# Altium schematic sheet Module A IO.SchDoc
size A2; SheetNumber: 4; SheetTotal: 7
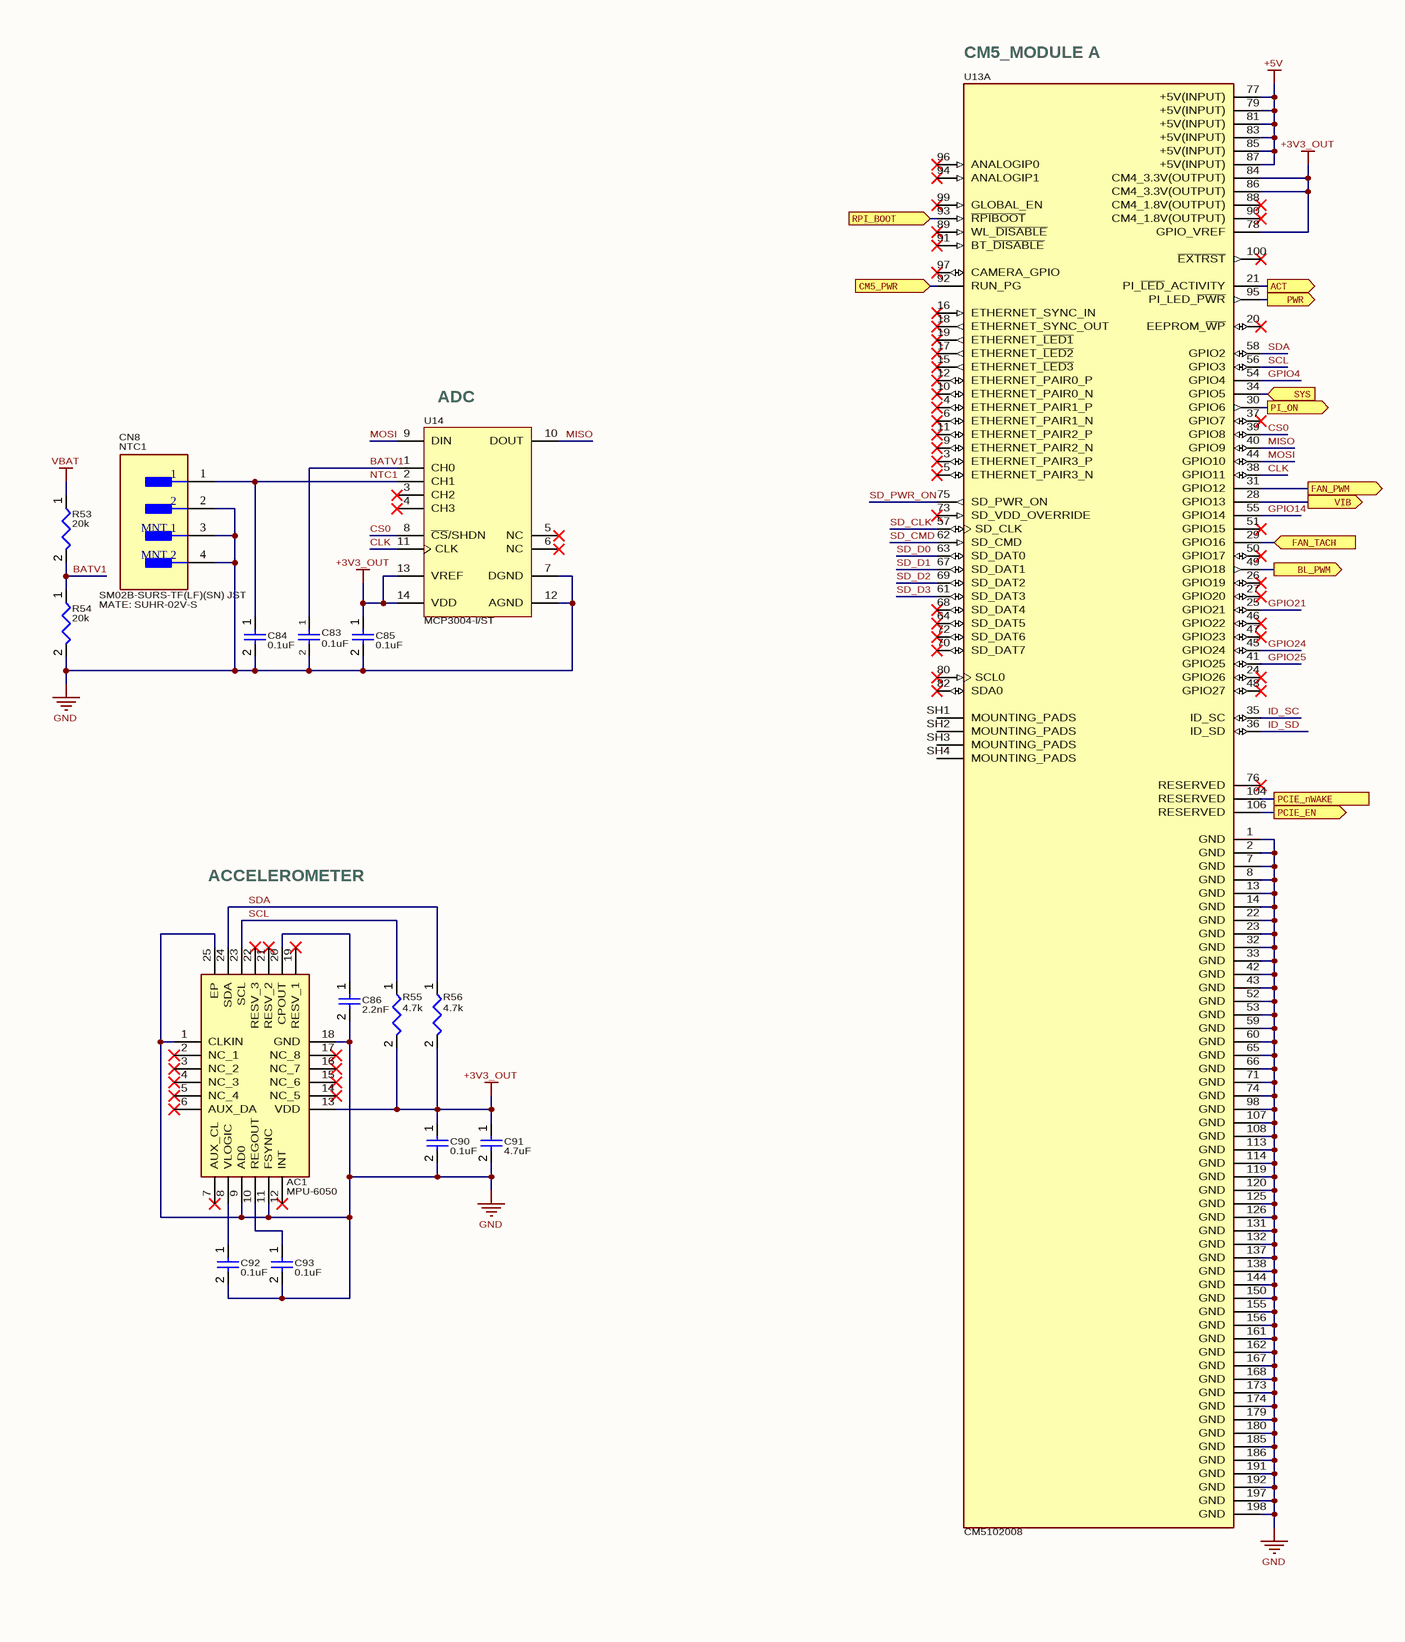
[diagram p0: Module A IO.SchDoc, left]
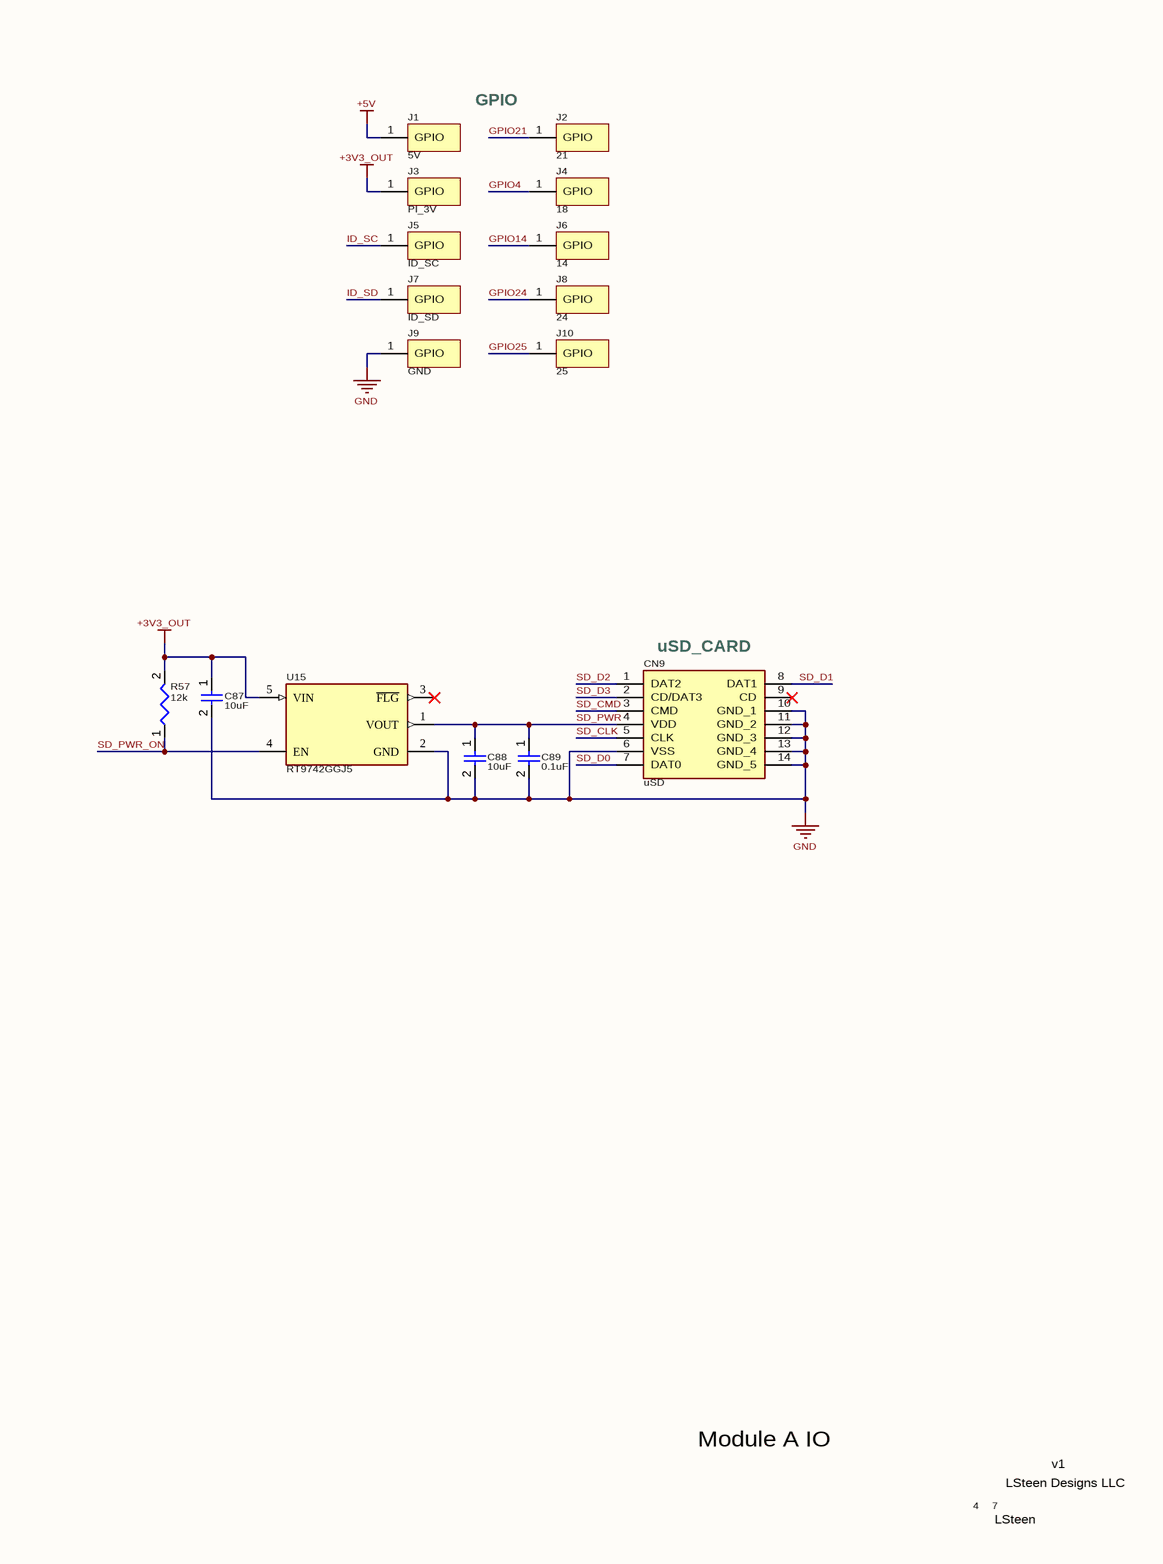
[diagram p1: Module A IO.SchDoc, right]

## Parts
AC1  MPU-6050  [MPU6050]
C83  0.1uF  [CAPC1005X55N]
C84  0.1uF  [CAPC1005X56X25LL10T15]
C85  0.1uF  [CAPC1005X56X25LL10T15]
C86  2.2nF  [CAPC1005X56X25LL10T15]
C87  10uF  [CAPC0603(1608)100_L]
C88  10uF  [CAPC0603(1608)100_L]
C89  0.1uF  [CAPC1005X56X25LL10T15]
C90  0.1uF  [CAPC1005X56X25LL10T15]
C91  4.7uF  [CAPC0603(1608)100_L]
C92  0.1uF  [CAPC1005X56X25LL10T15]
C93  0.1uF  [CAPC1005X56X25LL10T15]
CN8  NTC1  [FP-SM02B-SURS-TF_LF_SN-MFG]
CN9  uSD  [MSD9A]
J1  5V  [GPIO]
J2  21  [GPIO]
J3  PI_3V  [GPIO]
J4  18  [GPIO]
J5  ID_SC  [GPIO]
J6  14  [GPIO]
J7  ID_SD  [GPIO]
J8  24  [GPIO]
J9  GND  [GPIO]
J10  25  [GPIO]
R53  20k  [RESC0402(1005)_L]
R54  20k  [RESC0402(1005)_L]
R55  4.7k  [RESC0402(1005)_L]
R56  4.7k  [RESC0402(1005)_L]
R57  12k  [RESC0402(1005)_L]
U13  CM5102008  [MODULE_CM4102008]  (part A of 2)
U14  MCP3004-I/ST  [TSSOP-ST14_M]
U15  RT9742GGJ5  [FP-RT9742GGJ5-IPC_C]

## Ports
ACT (out, see USB[5B]), BL_PWM (out, see Power[5B]), CM5_PWR (in, see Power[5D]), FAN_PWM (out, see Power[4C]), FAN_TACH (in, see Power[4C]), PCIE_EN (out, see USB[6B]), PCIE_nWAKE (see USB[7B]), PI_ON (out, see Power[6D]), PWR (out, see USB[5B]), RPI_BOOT (in, see USB[6D]), SYS (in, see USB[5B]), VIB (out, see USB[7B])

## Nets
+3V3_OUT: AC1.13(VDD) C85.1 C87.1 C90.1 C91.1 J3.1(GPIO) R55.2 R56.2 R57.2 U13.78(GPIO_VREF) U13.84(CM4_3.3V(OUTPUT)) U13.86(CM4_3.3V(OUTPUT)) U14.13(VREF) U14.14(VDD) U15.5(VIN)
+5V: J1.1(GPIO) U13.77(+5V(INPUT)) U13.79(+5V(INPUT)) U13.81(+5V(INPUT)) U13.83(+5V(INPUT)) U13.85(+5V(INPUT)) U13.87(+5V(INPUT))
GND: AC1.1(CLKIN) AC1.9(AD0) AC1.11(FSYNC) AC1.18(GND) AC1.25(EP) C83.2 C84.2 C85.2 C86.2 C87.2 C88.2 C89.2 C90.2 C91.2 C92.2 C93.2 CN8.2 CN8.3(MNT_1) CN8.4(MNT_2) CN9.6(VSS) CN9.10(GND_1) CN9.11(GND_2) CN9.12(GND_3) CN9.13(GND_4) CN9.14(GND_5) J9.1(GPIO) R54.2 U13.1(GND) U13.2(GND) U13.7(GND) U13.8(GND) U13.13(GND) U13.14(GND) U13.22(GND) U13.23(GND) U13.32(GND) U13.33(GND) U13.42(GND) U13.43(GND) U13.52(GND) U13.53(GND) U13.59(GND) U13.60(GND) U13.65(GND) U13.66(GND) U13.71(GND) U13.74(GND) U13.98(GND) U13.107(GND) U13.108(GND) U13.113(GND) U13.114(GND) U13.119(GND) U13.120(GND) U13.125(GND) U13.126(GND) U13.131(GND) U13.132(GND) U13.137(GND) U13.138(GND) U13.144(GND) U13.150(GND) U13.155(GND) U13.156(GND) U13.161(GND) U13.162(GND) U13.167(GND) U13.168(GND) U13.173(GND) U13.174(GND) U13.179(GND) U13.180(GND) U13.185(GND) U13.186(GND) U13.191(GND) U13.192(GND) U13.197(GND) U13.198(GND) U14.7(DGND) U14.12(AGND) U15.2(GND)
VBAT: R53.1
ACT: U13.21(PI_~{LED}_ACTIVITY) ; port ACT
BATV1: C83.1 R53.2 R54.1 U14.1(CH0)
BL_PWM: U13.49(GPIO18) ; port BL_PWM
CLK: U13.38(GPIO11) U14.11(CLK)
CM5_PWR: U13.92(RUN_PG) ; port CM5_PWR
CS0: U13.39(GPIO8) U14.8(~{CS}/SHDN)
FAN_PWM: U13.31(GPIO12) ; port FAN_PWM
FAN_TACH: U13.29(GPIO16) ; port FAN_TACH
GPIO4: J4.1(GPIO) U13.54(GPIO4)
GPIO14: J6.1(GPIO) U13.55(GPIO14)
GPIO21: J2.1(GPIO) U13.25(GPIO21)
GPIO24: J8.1(GPIO) U13.45(GPIO24)
GPIO25: J10.1(GPIO) U13.41(GPIO25)
ID_SC: J5.1(GPIO) U13.35(ID_SC)
ID_SD: J7.1(GPIO) U13.36(ID_SD)
MISO: U13.40(GPIO9) U14.10(DOUT)
MOSI: U13.44(GPIO10) U14.9(DIN)
NTC1: C84.1 CN8.1 U14.2(CH1)
PCIE_EN: U13.106(RESERVED) ; port PCIE_EN
PCIE_nWAKE: U13.104(RESERVED) ; port PCIE_nWAKE
PI_ON: U13.30(GPIO6) ; port PI_ON
PWR: U13.95(PI_LED_~{PWR}) ; port PWR
RPI_BOOT: U13.93(~{RPIBOOT}) ; port RPI_BOOT
SCL: AC1.23(SCL) R55.1 U13.56(GPIO3)
SD_CLK: CN9.5(CLK) U13.57(SD_CLK)
SD_CMD: CN9.3(CMD) U13.62(SD_CMD)
SD_D0: CN9.7(DAT0) U13.63(SD_DAT0)
SD_D1: CN9.8(DAT1) U13.67(SD_DAT1)
SD_D2: CN9.1(DAT2) U13.69(SD_DAT2)
SD_D3: CN9.2(CD/DAT3) U13.61(SD_DAT3)
SD_PWR: C88.1 C89.1 CN9.4(VDD) U15.1(VOUT)
SD_PWR_ON: R57.1 U13.75(SD_PWR_ON) U15.4(EN)
SDA: AC1.24(SDA) R56.1 U13.58(GPIO2)
SYS: U13.34(GPIO5) ; port SYS
VIB: U13.28(GPIO13) ; port VIB
NetAC1_8: AC1.8(VLOGIC) C92.1
NetAC1_10: AC1.10(REGOUT) C93.1
NetAC1_20: AC1.20(CPOUT) C86.1

Not connected (* = marked no-connect by the designer): AC1 2(NC_1)* 3(NC_2)* 4(NC_3)* 5(NC_4)* 6(AUX_DA)* 7(AUX_CL)* 12(INT)* 14(NC_5)* 15(NC_6)* 16(NC_7)* 17(NC_8)* 19(RESV_1)* 21(RESV_2)* 22(RESV_3)*; CN9 9(CD)*; U13 3(ETHERNET_PAIR3_P)* 4(ETHERNET_PAIR1_P)* 5(ETHERNET_PAIR3_N)* 6(ETHERNET_PAIR1_N)* 9(ETHERNET_PAIR2_N)* 10(ETHERNET_PAIR0_N)* 11(ETHERNET_PAIR2_P)* 12(ETHERNET_PAIR0_P)* 15(ETHERNET_~{LED3})* 16(ETHERNET_SYNC_IN)* 17(ETHERNET_~{LED2})* 18(ETHERNET_SYNC_OUT)* 19(ETHERNET_~{LED1})* 20(EEPROM_~{WP})* 24(GPIO26)* 26(GPIO19)* 27(GPIO20)* 37(GPIO7)* 46(GPIO22)* 47(GPIO23)* 48(GPIO27)* 50(GPIO17)* 51(GPIO15)* 64(SD_DAT5)* 68(SD_DAT4)* 70(SD_DAT7)* 72(SD_DAT6)* 73(SD_VDD_OVERRIDE)* 76(RESERVED)* 80(SCL0)* 82(SDA0)* 88(CM4_1.8V(OUTPUT))* 89(WL_~{DISABLE})* 90(CM4_1.8V(OUTPUT))* 91(BT_~{DISABLE})* 94(ANALOGIP1)* 96(ANALOGIP0)* 97(CAMERA_GPIO)* 99(GLOBAL_EN)* 100(~{EXTRST})* SH1(MOUNTING_PADS) SH2(MOUNTING_PADS) SH3(MOUNTING_PADS) SH4(MOUNTING_PADS); U14 3(CH2)* 4(CH3)* 5(NC)* 6(NC)*; U15 3(~{FLG})*

## Notes on the sheet
- (near U13) CM5_MODULE A
- (near U14) ADC
- GPIO
- MATE: SUHR-02V-S
- SM02B-SURS-TF(LF)(SN) JST
- ACCELEROMETER
- (near CN9) uSD_CARD
- Module A IO
- 4
- 7
- LSteen
- LSteen Designs LLC
- v1

## Library data of the parts
AC1 = MPU-6050: Integrated Circuit; Manufacturer_Name: TDK; Datasheet Link: https://product.tdk.com/system/files/dam/doc/product/sensor/mortion-inertial/imu/data_sheet/mpu-6000-datasheet1.pdf; Height: 0.95mm; Manufacturer_Part_Number: MPU-6050; Mouser Part Number: 410-MPU-6050; Mouser Price/Stock: https://www.mouser.co.uk/ProductDetail/TDK-InvenSense/MPU-6050?qs=u4fy%2FsgLU9O14B5JgyQFvg%3D%3D; Arrow Part Number: MPU-6050; Arrow Price/Stock: https://www.arrow.com/en/products/mpu-6050/invensense?region=nac; Supplier 1: LCSC; Supplier Part Number 1: C24112
C83 = C0402: Height: 0.55mm
C84 C85 C89 C90 C92 C93 = CMP-001-00001-6: Chip Capacitor, 0.1 uF, +/- 5%, 16 V, 0402 (1005 Metric); Capacitor Type: Ceramic; Voltage Rating: 16V; Max Operating Temperature: 125°C; Min Operating Temperature: -55°C; Case/Package: 0402; Value: 0.1uF; Mounting Technology: SM; Pins: 2; Tolerance: 5%; RoHS Compliant: True
C86 = CMP-001-00001-6: Chip Capacitor, 2.2nF, +/- 5%, 16 V, 0402 (1005 Metric); Capacitor Type: Ceramic; Voltage Rating: 16V; Max Operating Temperature: 125°C; Min Operating Temperature: -55°C; Case/Package: 0402; Value: 2.2nF; Mounting Technology: SM; Pins: 2; Tolerance: 5%; RoHS Compliant: True
C87 C88 = CMP-001-00076-4: Chip Capacitor, 10uF +/-20%, 10V, 0603, Thickness 1 mm; Tolerance: 10%; Mounting Technology: SMT; Case/Package: 0603; Pins: 2; Min Operating Temperature: -55°C; Max Operating Temperature: 85°C; Value: 10uF; Voltage Rating: 10V
C91 = CMP-001-00076-4: Chip Capacitor, 4.7uF +/-20%, 10V, 0603, Thickness 1 mm; Tolerance: 10%; Mounting Technology: SMT; Case/Package: 0603; Pins: 2; Min Operating Temperature: -55°C; Max Operating Temperature: 85°C; Value: 4.7uF; Voltage Rating: 10V
CN8 = CMP-17439-000279-1: LCSC_CONN HEADER SMD R/A 2POS 0.8MM; Number of Contacts: 2; Working Voltage: 30V; Wire/Cable Gauge: 32AWG; Gender: Male; Body Plating: Tin; Current Rating: 500mA; Lead Pitch: 0.8mm; Color: Natural; Min Operating Temperature: -25°C; Insulation Material: Nylon; Number of Rows: 1; Flammability Rating: UL94 V-0; Number of Positions: 2; Contact Shape: Rectangular; Orientation: Horizontal; Contact Material: Copper Alloy; Fastening Type: Pull; Max Operating Temperature: 85°C; Termination: Solder; Contact Type: Outer Shroud Contact; Series: SUR; Insulation Color: Natural; Packaging: Cut Tape; Contact Finish - Mating: TIN; REACH SVHC: No SVHC; Pitch: 0.8mm; Contact Plating: Tin; Lead Free: Lead Free; Voltage Rating: 30V; Mount: Surface Mount; Connector Type: Header; Number of Poles: 2; Material: Polyamide
CN9 = MSD-9-A: Connector; Manufacturer_Name: CUI Devices; Datasheet Link: https://www.cuidevices.com/product/resource/msd-9-a.pdf; Height: 1.65mm; Manufacturer_Part_Number: MSD-9-A; Supplier 1: Mouser; Supplier Part Number 1: 179-MSD-9-A
J1-J10 = GPIO: AUX_I/O
R53 R54 = CMP-009-00138-3: Chip Resistor, 20 kOhms, +/-5 %, 63 mW, -55 to 155 degC, 0402; Value: 40k; Tolerance: 5%; Power: 63mW; Max Operating Temperature: 155°C; Pins: 2; Min Operating Temperature: -55°C; Case/Package: 0402
R55 R56 = CMP-009-00138-3: Chip Resistor, 4.7 kOhms, +/-5 %, 63 mW, -55 to 155 degC, 0402; Tolerance: 5%; Power: 63mW; Max Operating Temperature: 155°C; Pins: 2; Value: 4.7k; Min Operating Temperature: -55°C; Case/Package: 0402
R57 = CMP-009-00138-3: Chip Resistor, 12 kOhms, +/-5 %, 63 mW, -55 to 155 degC, 0402; Tolerance: 5%; Power: 63mW; Max Operating Temperature: 155°C; Pins: 2; Value: 12k; Min Operating Temperature: -55°C; Case/Package: 0402
U13 = CM4102008: Raspberry Pi Compute Module 4 with WiFi 2GB RAM 8GB Flash | Raspberry Pi CM4102008; SnapEDA_Link: https://www.snapeda.com/parts/CM4102008/Raspberry+Pi/view-part/?ref=snap; Package: None; Value: *; MF: Raspberry Pi; MP: CM4102008; Check_prices: https://www.snapeda.com/parts/CM4102008/Raspberry+Pi/view-part/?ref=eda
U14 = CMP-0188-00879-2: 2.7V 4-Channel/8-Channel 10-Bit A/D Converters with SPI Serial Interface, 14-Pin TSSOP, Industrial Temperature; ComponentLink1URL: http://www.microchip.com/; RevisionNote: URLs added.; PackageDescription: 14-Lead Plastic Thin Shrink Small Outline (ST) - 4.4mm Body [TSSOP]; ComponentLink3Description: Package Specification; ComponentLink2Description: Datasheet; ComponentLink3URL: http://www.microchip.com/stellent/groups/techpub_sg/documents/packagingspec/en012702.pdf; PackageReference: TSSOP-ST14; PackageVersion: revBB, Aug-2009; ComponentLink1Description: Manufacturer URL; ComponentLink2URL: http://ww1.microchip.com/downloads/en/DeviceDoc/21295d.pdf; DatasheetVersion: revD, Dec-2008
U15 = CMP-79883-000001-1: IC PWR SWTCH N-CHAN 1:1 TSOT23-5; Interface: On/Off; Fault Protection: Over Temperature; Max Output Current: 1A; Number of Outputs: 1; Output Configuration: High Side; On-State Resistance: 70mR; REACH SVHC: No SVHC; Number of Pins: 23; Packaging: Tape and Reel; Case/Package: SOT-23-5; RoHS Compliant: Yes; Max Operating Temperature: 85°C; Min Operating Temperature: -40°C